# EAGLE design tweeq-FB_mOLED_v5 (EAGLE 7.2.0)
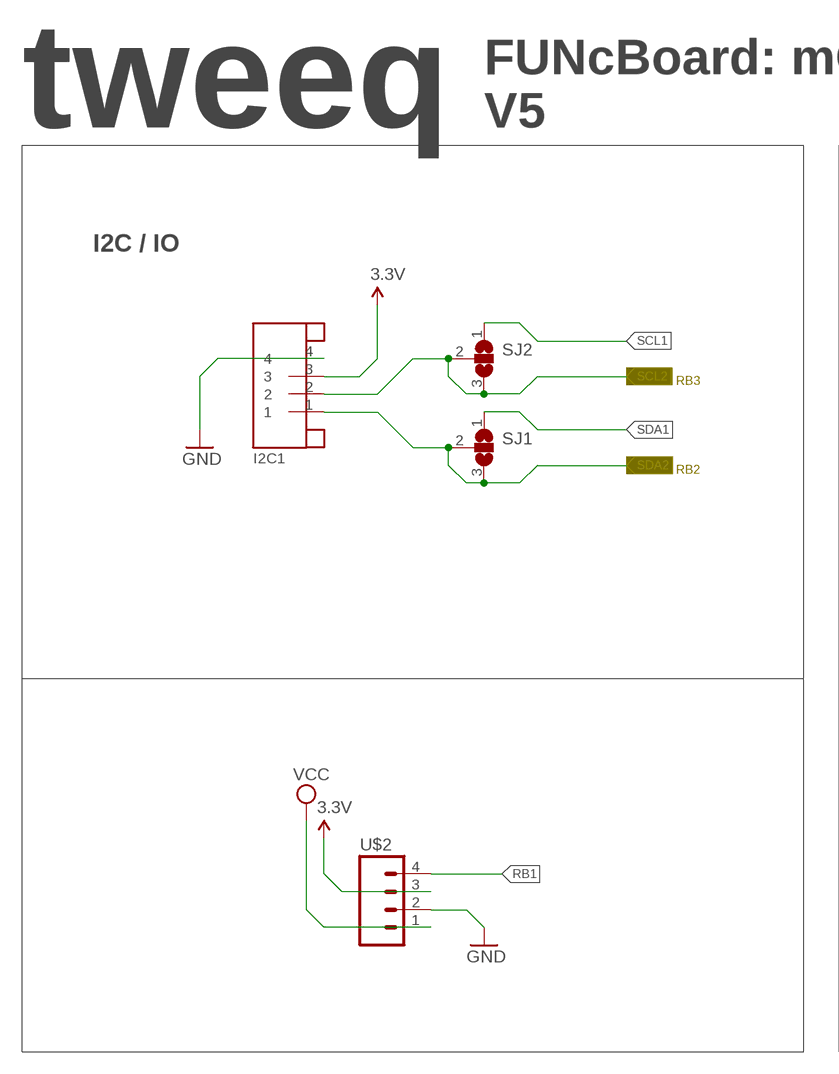
[diagram p0: schematic, sheet 1, part 1 of 2]
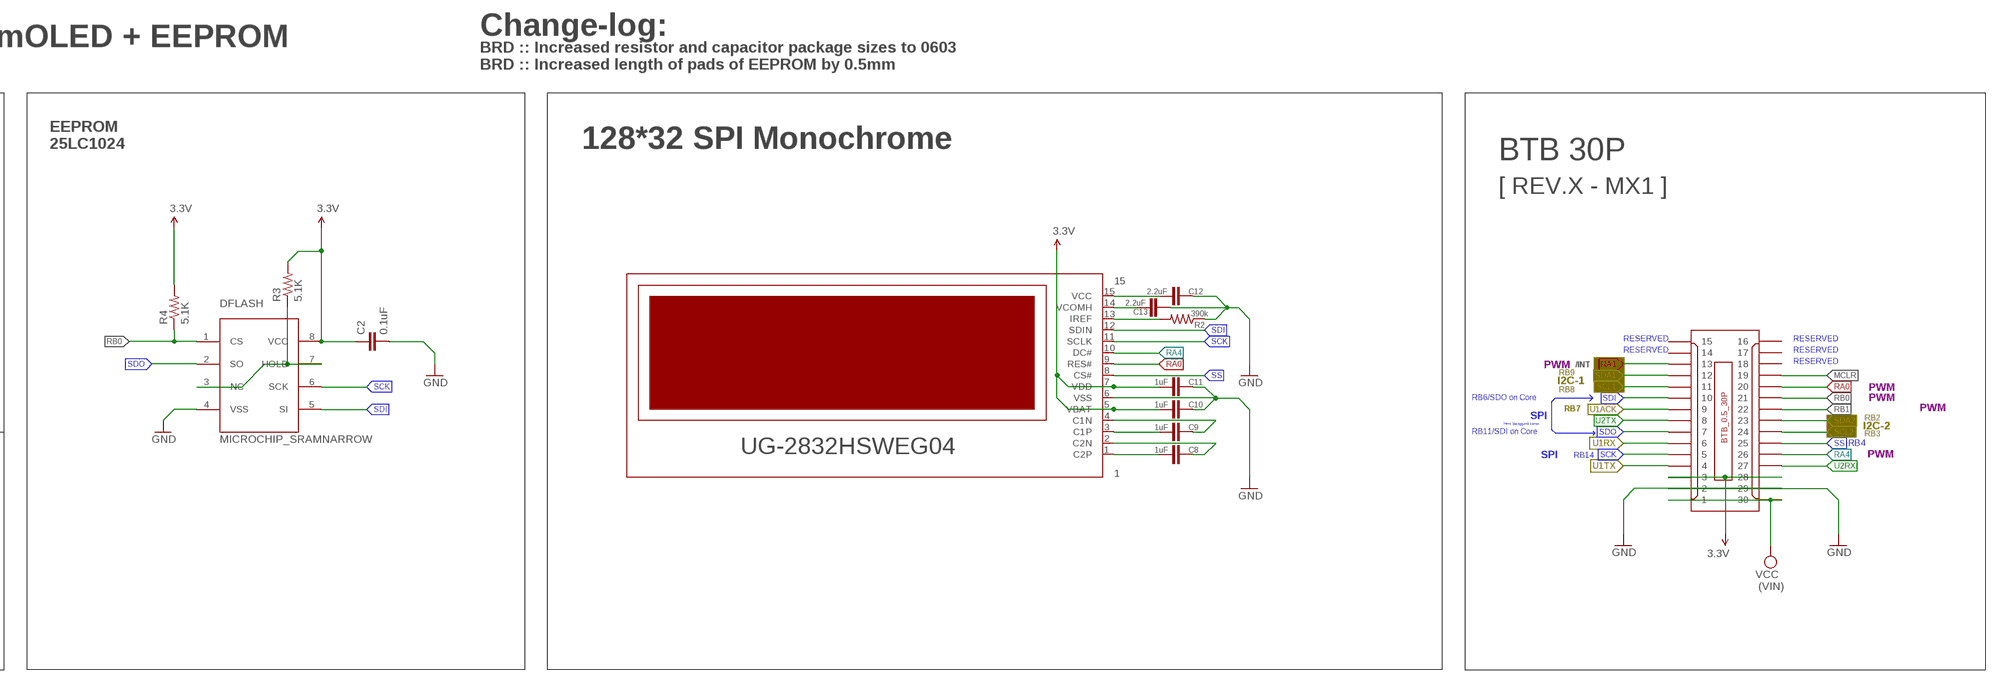
[diagram p1: schematic, sheet 1, part 2 of 2]

## Parts
C2  0.1uF  C-EUC0603  [C0603]
C8  1uF  C-EUC0603K  [C0603K]
C9  1uF  C-EUC0603K  [C0603K]
C10  1uF  C-EUC0603K  [C0603K]
C11  1uF  C-EUC0603K  [C0603K]
C12  2.2uF  C-EUC0603K  [C0603K]
C13  2.2uF  C-EUC0603K  [C0603K]
DFLASH  MICROCHIP_SRAMNARROW  [SOIC8]
I2C1  JST-4PINSH  [SH1.0-4PIN]
R2  390k  R-US_R0603  [R0603]
R3  5.1K  R-US_R0603  [R0603]
R4  5.1K  R-US_R0603  [R0603]
SJ1  JUMPER_SJ2WS  [JUMPER_SJ_S]
SJ2  JUMPER_SJ2WS  [JUMPER_SJ_S]
U$2  M04  [1X04_PAD]
U$3  UG-2832HSWEG04  [UG-2832HSWEG04]
U$4  BTB_CONN_30P/F  [BTB0.5-30F-3.0G]

## Nets
3.3V: C2.1 C10.1 C11.1 DFLASH.8(VCC) I2C1.3 R3.2 R4.2 U$2.3 U$3.5(VBAT) U$3.7(VDD) U$4.3 U$4.28
GND: C2.2 C10.2 C11.2 C12.2 C13.2 DFLASH.4(VSS) I2C1.4 R2.1 U$2.2 U$3.6(VSS) U$4.2 U$4.29
MCLR: U$4.19
N$6: C8.1 U$3.1(C2P)
N$7: C8.2 U$3.2(C2N)
N$10: DFLASH.3(NC) DFLASH.7(HOLD) R3.1
N$16: C9.1 U$3.3(C1P)
N$17: C9.2 U$3.4(C1N)
N$18: C12.1 U$3.15(VCC)
N$20: C13.1 U$3.14(VCOMH)
N$21: R2.2 U$3.13(IREF)
RA0: U$3.9(RES#) U$4.20
RA1: U$4.13
RA4: U$3.10(DC#) U$4.26
RB0: DFLASH.1(CS) R4.1 U$4.21
RB1: U$2.4 U$4.22
SCK: DFLASH.6(SCK) U$3.11(SCLK) U$4.5
SCL1: SJ2.1 U$4.11
SCL2: I2C1.2 SJ2.2 SJ2.3 U$4.24
SDA1: SJ1.1 U$4.12
SDA2: I2C1.1 SJ1.2 SJ1.3 U$4.23
SDI: DFLASH.5(SI) U$3.12(SDIN) U$4.10
SDO: DFLASH.2(SO) U$4.7
SS: U$3.8(CS#) U$4.25
U1ACK: U$4.9
U1RX: U$4.6
U1TX: U$4.4
U2RX: U$4.27
U2TX: U$4.8
VCC: U$2.1 U$4.1 U$4.30
Unconnected: U$4.14 U$4.15 U$4.16 U$4.17 U$4.18

## Notes on the sheet
- Change-log:
- FUNcBoard: mOLED + EEPROM
- BRD :: Increased resistor and capacitor package sizes to 0603
  BRD :: Increased length of pads of EEPROM by 0.5mm
- tweeq | V5
- EEPROM
  25LC1024
- 128*32 SPI Monochrome
- I2C / IO | BTB 30P
- [ REV.X - MX1 ]
- RB3
- RB2
- RESERVED | RESERVED
- RESERVED | RESERVED
- PWM | /INT
- RESERVED
- RB9
- I2C-1
- I2C-1
- RB8 | PWM
- RB6/SDO on Core | PWM
- RB7
- SPI | PWM
- RB2
- Pins Swapped Here.
- I2C-2
- RB11/SDI on Core | I2C-2
- RB3
- RB4
- SPI
- RB14 | PWM
- (VIN)

## Library data of the parts
C2 C8-C13 = AISCube:C-EU: CAPACITOR, European symbol
DFLASH = AISCube:MICROCHIP_SRAM
I2C1 = AISCube:JST-4PIN: JST 4 Pin
R2-R4 = AISCube:R-US_: RESISTOR, American symbol
SJ1 SJ2 = AISCube:JUMPER_SJ2W: SMD solder JUMPER
U$2 = AISCube:M04: 1x04 Pin Header Standard 2.54mm (0.1") header.
U$3 = AISCube:UG-2832HSWEG04: mOLED UG-2832HSWEG04 Folding Type OEL Display Module Pixel Number: 128 x 32, Monochrome, COG Package SSD1306
U$4 = AISCube:BTB_CONN_30P: Board to Board Connector SMD 0.5mm Pitch 30 way - Dual Side (2x15) Total Mating height: 3.0mm

## Board
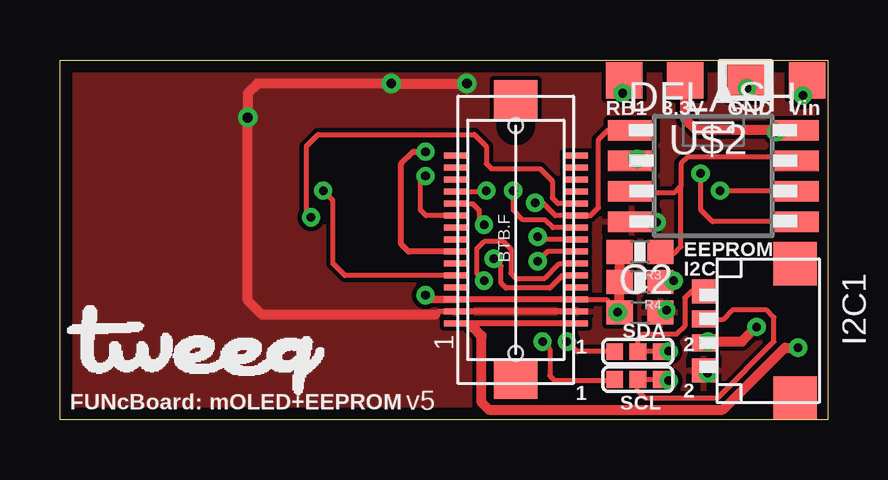
[diagram p2: board, top side]
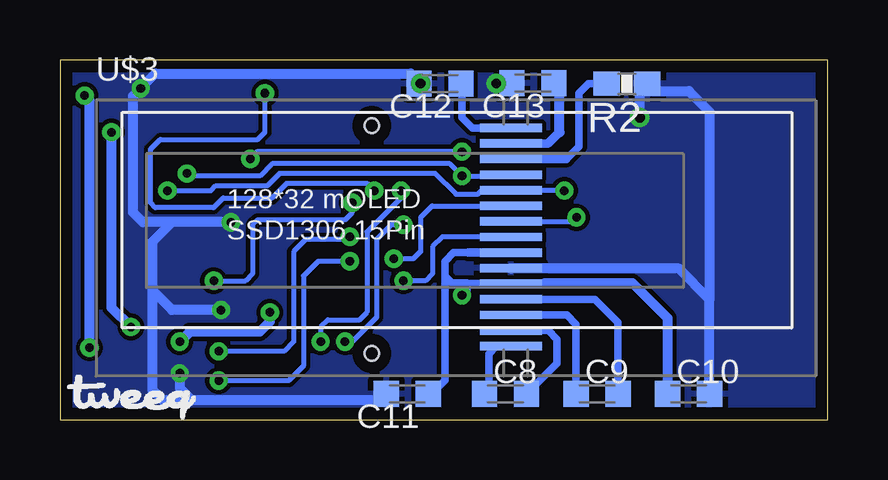
[diagram p3: board, bottom side, seen from below]

Size 32 x 15 mm. Coordinates in mm from the lower left corner, seen from the top.
Outline: 0,15 32,15 32,0 0,0 0,15
Copper layers (1*16): Top 0.0356mm / dielectric 1.5011mm / Bottom 0.0356mm
Design rules "AISCube": minimum track width 7mil, minimum drill 14mil, track to track 7mil, track to pad 7mil, pad to pad 7mil, via to via 7mil, smd to smd 0mil, copper to edge 20mil, drill to drill 8mil, minimum pad ring 10mil, minimum via ring 8mil, stop-mask expansion 4mil, vias tented up to drill 32mil, thermal gap 10mil

### Footprints (pad centres in the part's own frame; a part is rotated, then mirrored left to right if it is on the bottom)
C0603 = smd 1.1 x 1: 1 -0.85,0; 2 0.85,0
C0603K = smd 1.05 x 1.08: 1 -0.875,0; 2 0.875,0
SOIC8 = smd 2 x 0.85: 1 -3.4,1.905; 2 -3.4,0.635; 3 -3.4,-0.635; 4 -3.4,-1.905; 5 3.4,-1.905; 6 3.4,-0.635; 7 3.4,0.635; 8 3.4,1.905
SH1.0-4PIN = smd 1 x 1: 1 -1.65,-0.55; 4 1.65,-0.55 | smd 0.7 x 1: 2 -0.5,-0.55; 3 0.5,-0.55 | smd 1.8 x 1.8: P$1 -2.8,3.25; P$2 2.8,3.25
R0603 = smd 1.1 x 1: 1 -0.85,0; 2 0.85,0
JUMPER_SJ_S = smd 0.7 x 0.7: 1 -0.974,-0.02; 2 0,-0.02; 3 0.974,-0.02
1X04_PAD = smd 1.524 x 1.524: 1 -3.81,0; 2 -1.27,0; 3 1.27,0; 4 3.81,0
UG-2832HSWEG04 = smd 2.6 x 0.35: 1 17.3,1.25; 2 17.3,1.9; 3 17.3,2.55; 4 17.3,3.2; 5 17.3,3.85; 6 17.3,4.5; 7 17.3,5.15; 8 17.3,5.8; 9 17.3,6.45; 10 17.3,7.1; 11 17.3,7.75; 12 17.3,8.4; 13 17.3,9.05; 14 17.3,9.7; 15 17.3,10.35
BTB0.5-30F-3.0G = smd 0.25 x 1: 1 -3.495,2.49; 2 -2.995,2.49; 3 -2.495,2.49; 4 -1.995,2.49; 5 -1.495,2.49; 6 -0.995,2.49; 7 -0.495,2.49; 8 0.005,2.49; 9 0.505,2.49; 10 1.005,2.49; 11 1.505,2.49; 12 2.005,2.49; 13 2.505,2.49; 14 3.005,2.49; 15 3.505,2.49; 16 3.505,-2.51; 17 3.005,-2.51; 18 2.505,-2.51; 19 2.005,-2.51; 20 1.505,-2.51; 21 1.005,-2.51; 22 0.505,-2.51; 23 0.005,-2.51; 24 -0.495,-2.51; 25 -0.995,-2.51; 26 -1.495,-2.51; 27 -1.995,-2.51; 28 -2.495,-2.51; 29 -2.995,-2.51; 30 -3.495,-2.51 | smd 1.6 x 1.8: P$1 -5.845,0; P$2 5.855,0 | hole 0.6: -4.745,0; 4.755,0

### Placement (x,y rotation side)
C2  24.18,4.46 0 top
C8  13.43,1.08 0 bottom
C9  9.6,1.08 0 bottom
C10  5.79,1.08 0 bottom
C11  17.52,1.08 180 bottom
C12  16.16,14.01 180 bottom
C13  12.29,14.03 180 bottom
DFLASH  27.23,10.16 0 top
I2C1  27.4,3.7 270 top
R2  8.36,14.01 180 bottom
R3  24.18,7 180 top
R4  24.18,5.75 180 top
SJ1  24.1,2.86 0 top
SJ2  24.1,1.7 0 top
U$2  27.33,14.15 180 top
U$3  30.5,1.82 0 bottom
U$4  19,7.5 90 top
U$5  [TWEEQ-LOGO-L]  0.3,1.02 0 top
U$6  [TWEEQ-LOGO-S]  31.7,0 0 bottom

### Tracks (layer width: path | path; a pad name or v marks a point on that pad's centre or on a via)
3.3V  (via drill 0.36)
  Top 0.203: U$4.28 22.79,5 C2.1
  Top 0.254: U$4.28 U$4.3
  Top 0.305: U$4.3 15.42,5 v15.24,5.18
  Top 0.406: 30.8,11.99 DFLASH.8 30.86,12.09 30.26,12.09 | R3.2 R4.2 C2.1 v23.25,4.47 | I2C1.3 27.06,3.2 27.11,3.25 v27.01,3.25 28.43,3.25 v29.04,3.86 | U$2.3 26.06,12.53 26.5,12.09 30.26,12.09 | 30.26,12.09 v29.85,11.99
  Bottom 0.305: U$3.5 11.81,5.67 11.79,5.69 | 14.98,6.97 15.59,6.97 15.95,6.6 15.95,5.99 | 15.95,5.99 15.65,5.69 15.04,5.69 | 15.04,5.69 15.01,5.67 | 15.04,5.69 15.04,5.38 v15.24,5.18 | C11.1 16.5,1.07 15.95,1.63 15.95,5.99
  Bottom 0.356: U$3.5 15.01,5.67 | 14.98,6.97 U$3.7
  Bottom 0.406: 11.79,5.69 8.13,5.69 6.67,4.23 C10.1 | v23.25,4.47 23.25,4.08 23.67,3.66 26.6,3.66 v27.01,3.25 | v29.85,11.99 29.85,4.67 v29.04,3.86
GND  (via drill 0.36, 0.41)
  Top 0.203: U$4.2 15.78,4.5 15.65,4.37
  Top 0.254: U$4.29 U$4.2
  Top 0.406: I2C1.4 27.01,2.01 v27.01,1.93 | C2.2 25.22,4.71 v25.28,4.57 | DFLASH.4 24.85,8.21 v24.88,8.23 | U$2.2 28.6,13.85 v28.64,13.82 | 15.65,4.37 8.43,4.37 7.82,4.98 v7.82,12.6 7.82,13.61 8.23,14.02 v13.82,14.02 v16.97,14.02
  Bottom 0.305: C12.2 v16.98,14.01 v16.97,14.02
  Bottom 0.406: v27.01,1.93 27.01,1.32 26.5,0.81 | v24.88,8.23 27.33,8.23 | 27.33,8.23 28.55,8.23 28.96,8.64 28.96,13.5 v28.64,13.82 28.03,14.43 17.37,14.43 v16.97,14.02 | 26.5,0.81 18.66,0.81 C11.2 | 26.5,0.81 27.72,0.81 28.14,1.24 28.14,5.38 | 28.14,5.38 28.14,7.42 27.33,8.23 | v25.28,4.57 27.33,4.57 28.14,5.38 | v13.82,14.02 C13.2 | v7.82,12.6 7.82,13.7 | 7.82,13.7 R2.1 | C10.2 4.92,5.02 | 4.92,5.02 6.2,6.3 13.18,6.3 U$3.6 | 7.82,13.7 5.78,13.7 4.92,12.84 4.92,5.02
  pour Top: 0.2,14.83 31.86,14.83 31.86,0.2 0.2,0.2
  pour Bottom: 0.2,14.83 31.86,14.93 31.86,0.3 0.2,0.2
N$6
  Bottom 0.305: U$3.1 13.8,3.07 14.12,2.74 14.12,1.26 C8.1
N$7
  Bottom 0.305: U$3.2 11.64,3.72 11.28,3.35 11.28,2.35 C8.2
N$10
  Top 0.203: DFLASH.7 30.71,10.97 26.2,10.97 25.89,10.67 25.89,9.75 | R3.1 25.36,6.91 25.59,6.91 25.89,7.21 25.89,9.75 | 25.89,9.75 25.59,9.45 24.56,9.45 DFLASH.3
N$16
  Bottom 0.305: U$3.3 10.87,4.37 10.48,3.98 C9.1
N$17
  Bottom 0.305: U$3.4 9.69,5.02 8.73,4.06 C9.2
N$18
  Bottom 0.305: U$3.15 14.81,12.17 15.24,12.6 15.24,13.97 C12.1
N$20
  Bottom 0.356: U$3.14 11.65,11.52 11.18,11.99
  Bottom 0.406: 11.18,11.99 11.18,13.92 C13.1
N$21
  Bottom 0.305: R2.2 9.96,14.01 10.36,13.61 10.36,11.38 10.88,10.87
  Bottom 0.356: U$3.13 10.88,10.87
RA0  (via drill 0.36)
  Top 0.203: U$4.20 20.76,9.01 20.52,9.25 20.52,9.96 20.02,10.46 17.98,10.46 17.78,10.67 17.78,11.38 17.27,11.89 10.77,11.89 10.26,11.38 10.26,8.64 v10.46,8.43
  Bottom 0.203: U$3.9 10.63,8.27 v10.46,8.43
RA4  (via drill 0.36)
  Top 0.203: U$4.26 20.94,6 20.42,5.49 18.59,5.49 18.39,5.69 18.39,6.4 v18.09,6.71
  Bottom 0.203: v18.09,6.71 17.27,6.71 16.97,7.01 16.97,8.43 16.48,8.92 U$3.10
RB0  (via drill 0.36)
  Top 0.203: R4.1 25.55,5.75 v25.59,5.79 | v19.81,9.04 20.12,9.04 20.65,8.51 U$4.21 22.12,8.51 22.45,8.84 22.45,11.68 22.84,12.06 DFLASH.1
  Bottom 0.203: v19.81,9.04 19.81,8.64 20.12,8.33 23.76,8.33 23.96,8.13 23.96,6.1 24.27,5.79 v25.59,5.79
RB1  (via drill 0.36)
  Top 0.203: 23.52,13.99 U$2.4 23.45,14.08 v23.45,13.61 | U$4.22 20.55,8.01 20.22,8.33 19.3,8.33 18.9,8.74 v18.9,9.55
  Bottom 0.203: v23.45,13.61 23.45,11.99 23.76,11.68 27.82,11.68 28.23,11.28 28.23,9.04 28.03,8.84 25.6,8.84 25.2,9.25 23.15,9.25 22.54,9.86 19.2,9.86 v18.9,9.55
SCK  (via drill 0.36)
  Top 0.203: U$4.5 11.88,6 11.38,6.5 11.38,9.14 v10.97,9.55 | DFLASH.6 27.54,9.53 v27.52,9.55
  Bottom 0.203: v10.97,9.55 13.18,9.55 U$3.11 13.23,9.6 14.38,9.6 14.58,9.4 15.49,9.4 16.36,10.26 22.84,10.26 23.35,9.75 25.5,9.75 25.7,9.55 v27.52,9.55
  Bottom 0.254: 13.22,9.55 U$3.11
SCL1  (via drill 0.36)
  Top 0.203: 23.18,1.73 SJ2.1 23.37,1.63 20.62,1.63 20.42,1.83 20.42,2.95 v20.12,3.25 | U$4.11 17.21,9.01 17.48,8.74 17.48,8.33 v17.68,8.13
  Bottom 0.203: v17.68,8.13 18.19,8.13 18.8,7.52 18.8,4.27 19.81,3.25 v20.12,3.25
SCL2  (via drill 0.36)
  Top 0.203: 25.43,1.58 v25.38,1.63 25.37,1.51 SJ2.3 SJ2.2 24.08,1.67 24.08,1.22 24.38,0.91 27.43,0.91 29.77,3.25 29.77,4.27 29.46,4.57 28.04,4.57 27.64,4.17 26.88,4.17 I2C1.2 | I2C1.2 26.59,4.2 | U$4.24 20.32,7 v19.91,6.6 | 26.91,4.27 I2C1.2
  Bottom 0.203: v25.38,1.63 22.45,1.63 21.84,2.23 21.84,5.99 21.23,6.6 v19.91,6.6
SDA1  (via drill 0.36)
  Top 0.203: U$4.12 17.73,9.51 v17.78,9.55 | SJ1.1 21.55,2.84 v21.13,3.25
  Bottom 0.203: v17.78,9.55 17.78,9.25 19.2,7.82 19.2,4.47 19.51,4.17 20.83,4.17 21.13,3.86 v21.13,3.25
SDA2  (via drill 0.36)
  Top 0.203: U$4.23 20.03,7.5 v19.91,7.62 | 27.02,5.38 I2C1.1 | 26.5,5.28 26.98,5.28 I2C1.1 | I2C1.1 26.31,5.35 26.04,5.08 26.04,3.9 25.7,3.56 24.28,3.56 24.08,3.35 24.08,2.85 SJ1.2 v25.38,2.85 v25.38,2.84 SJ1.3
  Bottom 0.203: v19.91,7.62 20.03,7.5 21.76,7.5 22.25,7.01 22.25,3.25 22.66,2.85 v25.38,2.85
SDI  (via drill 0.36)
  Top 0.203: U$4.10 15.27,8.51 15.04,8.74 15.04,9.96 v15.24,10.16 | DFLASH.5 27.2,8.26 26.72,8.74 26.72,10.25 v26.7,10.26
  Bottom 0.203: U$3.12 13.26,10.16 v15.24,10.16 15.75,10.67 23.15,10.67 23.66,10.16 26.6,10.16 v26.7,10.26
SDO  (via drill 0.36)
  Top 0.254: DFLASH.2 24.51,10.77 24.16,10.77 v24.06,10.87 | U$4.7 14.53,7 14.22,7.32 14.22,10.67 14.73,11.18 v15.24,11.18
  Bottom 0.254: v24.06,10.87 23.76,11.18 v15.24,11.18
SS  (via drill 0.36)
  Top 0.203: v17.68,5.79 17.37,6.1 17.37,7.11 17.68,7.42 18.49,7.42 18.8,7.11 18.8,6.1 19,5.89 20.22,5.89 20.83,6.5 U$4.25
  Bottom 0.203: U$3.8 16.06,7.62 16.46,7.21 16.46,6.1 16.76,5.79 v17.68,5.79
VCC  (via drill 0.36)
  Top 0.203: 17.58,3.45 17.58,3.5 | U$4.1 17.03,4 17.17,3.86
  Top 0.254: U$4.30 U$4.1
  Top 0.406: v30.97,13.51 30.97,13.98 U$2.1 | 17.58,3.45 17.58,0.71 17.88,0.41 27.64,0.41 30.23,3 v30.77,3 | 17.17,3.86 17.21,3.86 17.58,3.5
  Bottom 0.406: v30.77,3 30.77,13.31 v30.97,13.51

### Text on the board
tPlace: RB1 | 3.3V | GND | Vin | EEPROM | I2C | 1 | SDA | 2 | 1 | 2 | FUNcBoard: mOLED+EEPROM | v5 | SCL